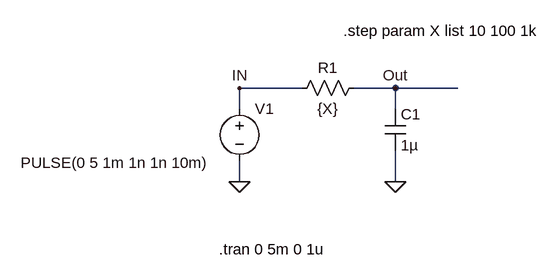
[diagram p0: schematic Draft10.asc]
Draft10.asc, the LTspice schematic file:
Version 4.1
SHEET 1 880 680
WIRE 208 112 112 112
WIRE 352 112 288 112
WIRE 448 112 352 112
WIRE 112 144 112 112
WIRE 352 144 352 112
WIRE 112 256 112 224
WIRE 352 256 352 208
FLAG 112 256 0
FLAG 352 256 0
FLAG 112 112 IN
FLAG 352 112 Out
SYMBOL voltage 112 128 R0
WINDOW 3 -337 99 Left 2
WINDOW 123 0 0 Left 0
WINDOW 39 0 0 Left 0
SYMATTR InstName V1
SYMATTR Value PULSE(0 5 1m 1n 1n 10m)
SYMBOL res 304 96 R90
WINDOW 0 0 56 VBottom 2
WINDOW 3 32 56 VTop 2
SYMATTR InstName R1
SYMATTR Value {X}
SYMBOL cap 336 144 R0
SYMATTR InstName C1
SYMATTR Value 1µ
TEXT 272 24 Left 2 !.step param X list 10 100 1k
TEXT 80 360 Left 2 !.tran 0 5m 0 1u

The netlist it stands for:
* Draft10.asc
V1 IN 0 PULSE(0 5 1m 1n 1n 10m)
R1 Out IN {X}
C1 Out 0 1µ
.step param X list 10 100 1k
.tran 0 5m 0 1u
.backanno
.end